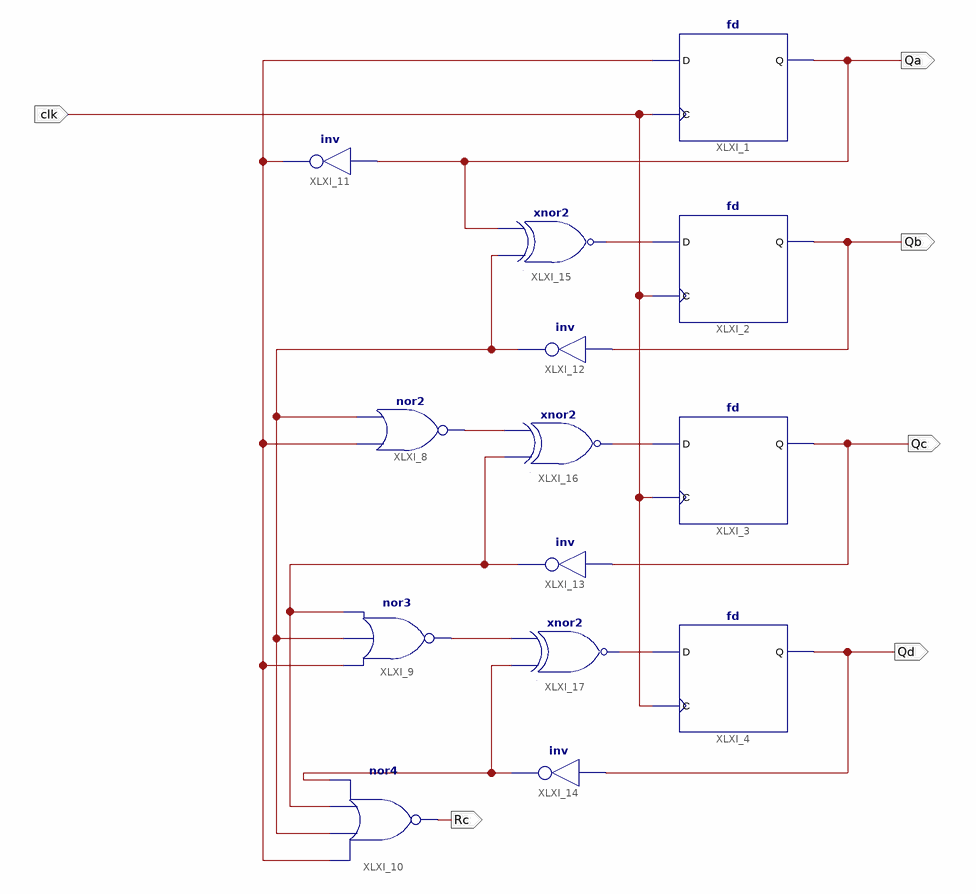
[diagram p0: schematic sheet 1]
// Xilinx ISE schematic Counter_4bit.sch (kintex7) as structural Verilog: 14 symbols, 6 ports
module Counter_4bit (
  input  clk,
  output Qa,
  output Qd,
  output Qc,
  output Qb,
  output Rc
);

  wire XLXN_3, XLXN_8, XLXN_9, XLXN_20, XLXN_23, XLXN_24, XLXN_25, XLXN_26, XLXN_27;

  fd XLXI_1 (.C(clk), .D(XLXN_3), .Q(Qa));
  fd XLXI_2 (.C(clk), .D(XLXN_8), .Q(Qb));
  fd XLXI_3 (.C(clk), .D(XLXN_20), .Q(Qc));
  fd XLXI_4 (.C(clk), .D(XLXN_23), .Q(Qd));
  nor XLXI_8 (XLXN_24, XLXN_3, XLXN_9);
  nor XLXI_9 (XLXN_26, XLXN_3, XLXN_9, XLXN_25);
  nor XLXI_10 (Rc, XLXN_3, XLXN_9, XLXN_25, XLXN_27);
  not XLXI_11 (XLXN_3, Qa);
  not XLXI_12 (XLXN_9, Qb);
  not XLXI_13 (XLXN_25, Qc);
  not XLXI_14 (XLXN_27, Qd);
  xnor XLXI_15 (XLXN_8, XLXN_9, Qa);
  xnor XLXI_16 (XLXN_20, XLXN_25, XLXN_24);
  xnor XLXI_17 (XLXN_23, XLXN_27, XLXN_26);
endmodule
